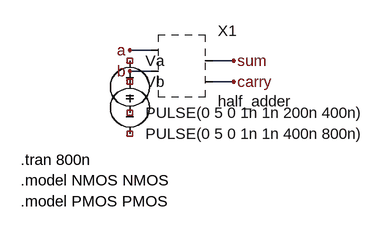
[diagram p0: schematic half_adder_test.asc]
half_adder_test.asc, the LTspice schematic file:
Version 4
.lib "C:\Users\ryano\OneDrive\Desktop\LogicLibraryAlt\simulation_build\ModelSp2025.txt".include "NAND.asc"
.include "INVERT.asc"
.include "ANDx.asc"
SHEET 1 880 680
WIRE 176 128 144 128
WIRE 176 160 144 160
WIRE 304 144 272 144
WIRE 304 176 272 176
FLAG 304 144 sum
FLAG 304 176 carry
FLAG 144 128 a
FLAG 144 160 b
SYMBOL half_adder 224 144 R0
SYMATTR InstName X1
SYMBOL voltage 144 128 R0
WINDOW 123 0 0 Left 0
WINDOW 39 0 0 Left 0
SYMATTR InstName Va
SYMATTR Value PULSE(0 5 0 1n 1n 200n 400n)
SYMBOL voltage 144 160 R0
WINDOW 123 0 0 Left 0
WINDOW 39 0 0 Left 0
SYMATTR InstName Vb
SYMATTR Value PULSE(0 5 0 1n 1n 400n 800n)
TEXT -24 296 Left 2 !.tran 800n
TEXT -24 328 Left 2 !.model NMOS NMOS
TEXT -24 360 Left 2 !.model PMOS PMOS

The netlist it stands for:
* half_adder_test.asc
* X1: half_adder (symbol half_adder not available, pin order unknown); nets seen at it: a, b, carry, sum
Va NC_01 NC_02 PULSE(0 5 0 1n 1n 200n 400n)
Vb NC_03 NC_04 PULSE(0 5 0 1n 1n 400n 800n)
.tran 800n
.model NMOS NMOS
.model PMOS PMOS
.backanno
.end